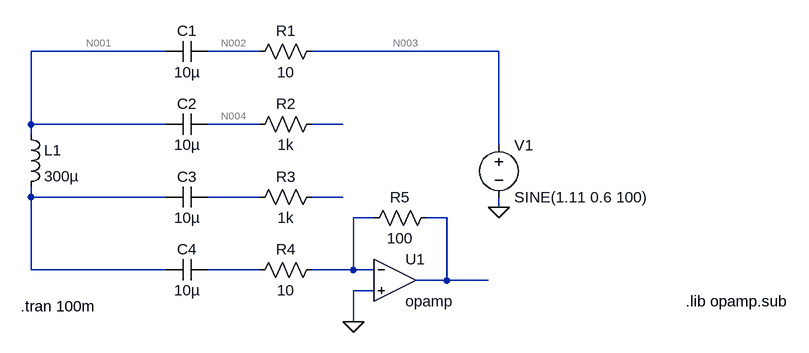
[diagram p0: schematic teste sistema.asc]
teste sistema.asc, the LTspice schematic file:
Version 4.1
SHEET 1 1356 680
WIRE 384 48 176 48
WIRE 528 48 448 48
WIRE 896 48 608 48
WIRE 176 160 176 48
WIRE 384 160 176 160
WIRE 528 160 448 160
WIRE 656 160 608 160
WIRE 176 176 176 160
WIRE 896 192 896 48
WIRE 176 272 176 256
WIRE 384 272 176 272
WIRE 528 272 448 272
WIRE 656 272 608 272
WIRE 896 288 896 272
WIRE 704 304 672 304
WIRE 816 304 784 304
WIRE 176 384 176 272
WIRE 384 384 176 384
WIRE 528 384 448 384
WIRE 672 384 672 304
WIRE 672 384 608 384
WIRE 704 384 672 384
WIRE 816 400 816 304
WIRE 816 400 768 400
WIRE 880 400 816 400
WIRE 704 416 672 416
WIRE 672 464 672 416
FLAG 896 288 0
FLAG 672 464 0
SYMBOL ind 160 160 R0
SYMATTR InstName L1
SYMATTR Value 300µ
SYMATTR SpiceLine Rser=10m
SYMBOL res 624 32 R90
WINDOW 0 0 56 VBottom 2
WINDOW 3 32 56 VTop 2
SYMATTR InstName R1
SYMATTR Value 10
SYMBOL cap 448 32 R90
WINDOW 0 0 32 VBottom 2
WINDOW 3 32 32 VTop 2
SYMATTR InstName C1
SYMATTR Value 10µ
SYMBOL res 624 144 R90
WINDOW 0 0 56 VBottom 2
WINDOW 3 32 56 VTop 2
SYMATTR InstName R2
SYMATTR Value 1k
SYMBOL cap 448 144 R90
WINDOW 0 0 32 VBottom 2
WINDOW 3 32 32 VTop 2
SYMATTR InstName C2
SYMATTR Value 10µ
SYMBOL res 624 256 R90
WINDOW 0 0 56 VBottom 2
WINDOW 3 32 56 VTop 2
SYMATTR InstName R3
SYMATTR Value 1k
SYMBOL cap 448 256 R90
WINDOW 0 0 32 VBottom 2
WINDOW 3 32 32 VTop 2
SYMATTR InstName C3
SYMATTR Value 10µ
SYMBOL res 624 368 R90
WINDOW 0 0 56 VBottom 2
WINDOW 3 32 56 VTop 2
SYMATTR InstName R4
SYMATTR Value 10
SYMBOL cap 448 368 R90
WINDOW 0 0 32 VBottom 2
WINDOW 3 32 32 VTop 2
SYMATTR InstName C4
SYMATTR Value 10µ
SYMBOL voltage 896 176 R0
WINDOW 123 0 0 Left 0
WINDOW 39 0 0 Left 0
SYMATTR InstName V1
SYMATTR Value SINE(1.11 0.6 100)
SYMBOL OpAmps\\opamp 736 336 R0
SYMATTR InstName U1
SYMBOL res 800 288 R90
WINDOW 0 0 56 VBottom 2
WINDOW 3 32 56 VTop 2
SYMATTR InstName R5
SYMATTR Value 100
TEXT 160 440 Left 2 !.tran 100m
TEXT 1184 432 Left 2 !.lib opamp.sub

The netlist it stands for:
* teste sistema.asc
L1 N001 N006 300µ Rser=10m
R1 N003 N002 10
C1 N002 N001 10µ
R2 N005 N004 1k
C2 N004 N001 10µ
R3 N008 N007 1k
C3 N007 N006 10µ
R4 N009 N011 10
C4 N011 N006 10µ
V1 N003 0 SINE(1.11 0.6 100)
X§U1 N009 0 N010 opamp Aol=100K GBW=10Meg  ; pins invin noninvin out
R5 N010 N009 100
.tran 100m
.lib opamp.sub
.backanno
.end

* Results of the author's LTspice run, read from the files saved beside the schematic
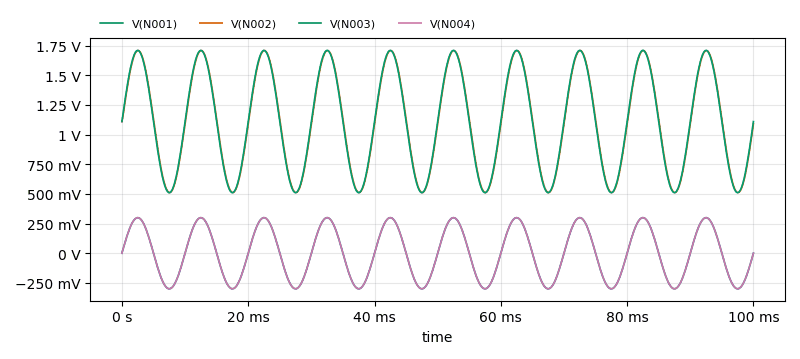
[diagram p1: Transient Analysis of teste sistema.asc, plotted from the saved traces]
* Transient Analysis, 1 run:
*   V(N001): min -299.8 mV, max 299.8 mV, average 14.03 µV, rms 212 mV, last 32.08 µV
*   V(N002): min 510.9 mV, max 1.709 V, average 1.11 V, rms 1.188 V, last 1.091 V
*   V(N003): min 510 mV, max 1.71 V, average 1.11 V, rms 1.188 V, last 1.11 V
*   V(N004): min -299.8 mV, max 299.8 mV, average 14.03 µV, rms 212 mV, last 32.08 µV